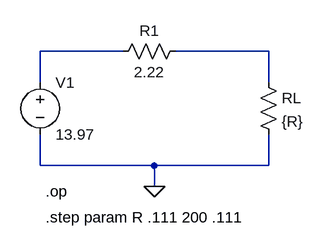
[diagram p0: schematic Question_2b.asc]
Question_2b.asc, the LTspice schematic file:
Version 4
SHEET 1 880 680
WIRE 224 256 96 256
WIRE 448 256 304 256
WIRE 96 304 96 256
WIRE 448 304 448 256
WIRE 96 432 96 384
WIRE 272 432 96 432
WIRE 448 432 448 384
WIRE 448 432 272 432
WIRE 272 464 272 432
FLAG 272 464 0
SYMBOL voltage 96 288 R0
SYMATTR InstName V1
SYMATTR Value 13.97
SYMBOL res 320 240 R90
WINDOW 0 0 56 VBottom 2
WINDOW 3 32 56 VTop 2
SYMATTR InstName R1
SYMATTR Value 2.22
SYMBOL res 432 288 R0
SYMATTR InstName RL
SYMATTR Value {R}
TEXT 104 472 Left 2 !.op
TEXT 104 512 Left 2 !.step param R .111 200 .111

The netlist it stands for:
* Question_2b.asc
V1 N001 0 13.97
R1 N002 N001 2.22
RL N002 0 {R}
.op
.step param R .111 200 .111
.backanno
.end